# Altium schematic sheet photodiode_pcb.SchDoc
size 297 x 210 mm
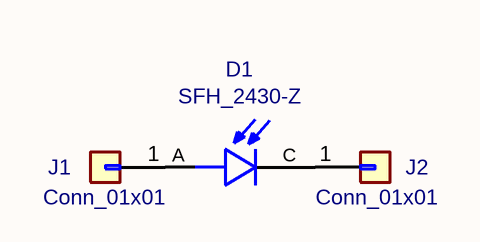
[diagram p0: photodiode_pcb.SchDoc]

## Parts
D1  SFH_2430-Z  [DIO_SFH_2430-Z]
J1  Conn_01x01  [PinHeader_1x01_P2.54mm_Vertical]
J2  Conn_01x01  [PinHeader_1x01_P2.54mm_Vertical]

## Nets
NetD1_A: D1.A J1.1(Pin_1)
NetD1_C: D1.C J2.1(Pin_1)

## Notes on the sheet
- 1
- 2
- 3
- 4
- 5
- 6
- A
- B
- C
- D
- Title:
- File: photodiode_pcb.sch
- Sheet: /
- KiCad E.D.A.  kicad (5.1.4)-1
- Size: A4
- Date:
- Rev:
- Id: 1/1

## Library data of the parts
D1 = SFH_2430-Z: MANUFACTURER: OSRAM; PARTREV: 1.3; MAXIMUM_PACKAGE_HEIGHT: 1.2mm; STANDARD: Manufacturer recommendations; Value: SFH_2430-Z
J1 J2 = Conn_01x01: Value: Conn_01x01; Footprint: Connector_PinHeader_2.54mm:PinHeader_1x01_P2.54mm_Vertical